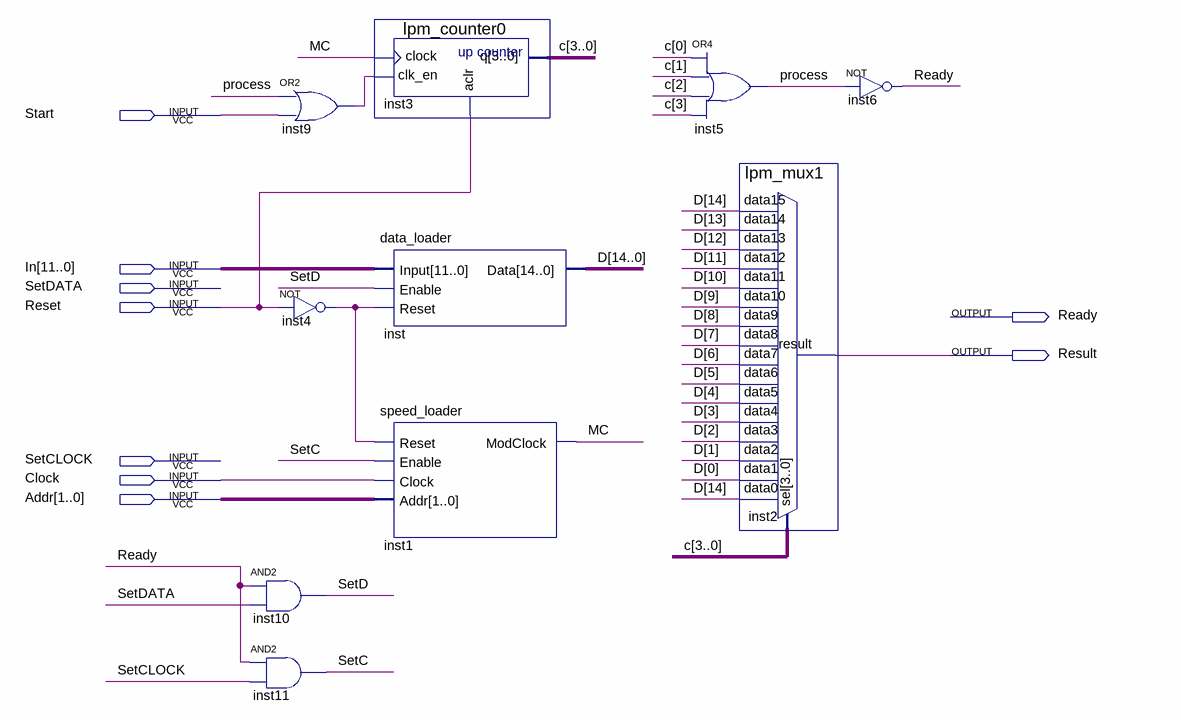
[diagram p0: schematic sheet]
// Quartus schematic scheme_mux.bdf as structural Verilog: 10 symbols, 9 pins
module scheme_mux (
  input  Start,
  input  [11:0] In,
  input  SetDATA,
  input  Reset,
  input  SetCLOCK,
  input  Clock,
  input  [1:0] Addr,
  output Ready,
  output Result
);

  wire inst4_out, inst9_out, MC, process, SetC, SetD;
  wire [3:0] c;
  wire [14:0] D;

  and inst10 (SetD, Ready, SetDATA);
  and inst11 (SetC, Ready, SetCLOCK);
  or inst9 (inst9_out, process, Start);
  not inst4 (inst4_out, Reset);
  lpm_counter0 inst3 (.clock(MC), .clk_en(inst9_out), .aclr(Reset), .q(c));
  data_loader inst (.Input(In), .Enable(SetD), .Reset(inst4_out), .Data(D));
  speed_loader inst1 (.Reset(inst4_out), .Enable(SetC), .Clock(Clock), .Addr(Addr), .ModClock(MC));
  or inst5 (process, c[0], c[1], c[2], c[3]);
  lpm_mux1 inst2 (
    .data15(D[14]), .data14(D[13]), .data13(D[12]), .data12(D[11]), .data11(D[10]), .data10(D[9]),
    .data9(D[8]), .data8(D[7]), .data7(D[6]), .data6(D[5]), .data5(D[4]), .data4(D[3]), .data3(D[2]),
    .data2(D[1]), .data1(D[0]), .data0(D[14]), .sel(c), .result(Result));
  not inst6 (Ready, process);
endmodule
